# EAGLE schematic atmega32u4 (EAGLE 9.5.2)
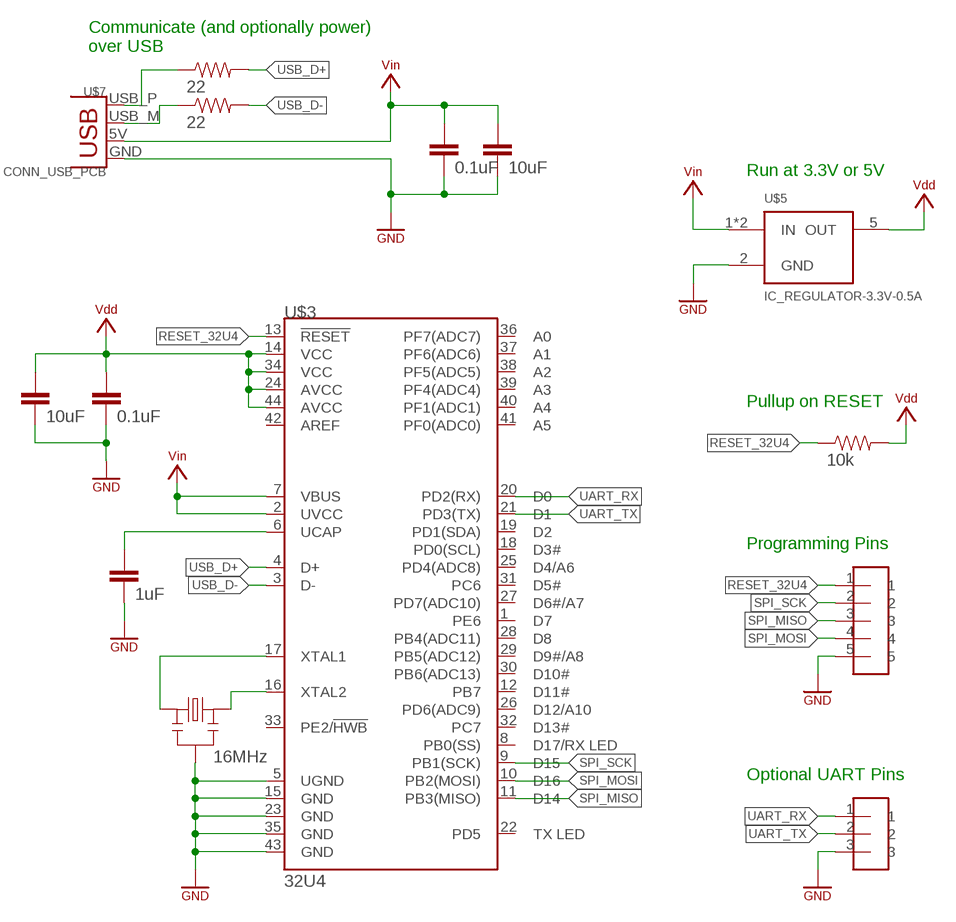
[diagram p0: schematic, sheet 1]

## Parts
C1  0.1uF  COMPONENT_CAP-0805  [0805]
C2  10uF  COMPONENT_CAP-0805  [0805]
C3  1uF  COMPONENT_CAP-0805  [0805]
C4  0.1uF  COMPONENT_CAP-0805  [0805]
C5  10uF  COMPONENT_CAP-0805  [0805]
R1  10k  COMPONENT_RESISTOR-0805  [0805]
R2  22  COMPONENT_RESISTOR-0805  [0805]
R3  22  COMPONENT_RESISTOR-0805  [0805]
U$1  HEADER-3-TESTPOINT  [TESTPOINT-3]
U$2  HEADER-5-TESTPOINT  [TESTPOINT-5]
U$3  32U4  MICRO_ATMEGA32U4TQFP-44  [TQFP44]
U$5  IC_REGULATOR-3.3V-0.5A  [SOT23-5]
U$7  CONN_USB_PCB  [USB-PCB]
Y1  16MHz  COMPONENT_RESONATOR-1.2MM-PITCH  [RESONATOR-SMD]

## Nets
GND: C1.2 C2.2 C3.2 C4.2 C5.2 U$1.3 U$2.5 U$3.5(UGND) U$3.15(GND) U$3.23(GND) U$3.35(GND) U$3.43(GND) U$5.2(GND) U$7.GND Y1.2 ; supply symbol labelled SYMBOL_GND
N$1: U$3.17(XTAL1) Y1.1
N$2: U$3.16(XTAL2) Y1.3
N$3: C3.1 U$3.6(UCAP)
N$5: R3.1 U$7.USB_M(D-)
N$6: R2.1 U$7.USB_P(D+)
RESET_32U4: R1.1 U$2.1 U$3.13(!RESET)
SPI_MISO: U$2.3 U$3.11(PB3(MISO))
SPI_MOSI: U$2.4 U$3.10(PB2(MOSI))
SPI_SCK: U$2.2 U$3.9(PB1(SCK))
UART_RX: U$1.1 U$3.20(PD2(RX))
UART_TX: U$1.2 U$3.21(PD3(TX))
USB_D+: R2.2 U$3.4(D+)
USB_D-: R3.2 U$3.3(D-)
VDD: C1.1 C2.1 R1.2 U$3.14(VCC) U$3.24(AVCC) U$3.34(VCC) U$3.44(AVCC) U$5.5(OUT) ; supply symbol labelled SYMBOL_VDD
VIN: C4.1 C5.1 U$3.2(UVCC) U$3.7(VBUS) U$5.1(IN) U$5.3(IN) U$7.5V(VBUS) ; supply symbol labelled SYMBOL_VIN
Unconnected: U$3.1(PE6) U$3.8(PB0(SS)) U$3.12(PB7) U$3.18(PD0(SCL)) U$3.19(PD1(SDA)) U$3.22(PD5) U$3.25(PD4(ADC8)) U$3.26(PD6(ADC9)) U$3.27(PD7(ADC10)) U$3.28(PB4(ADC11)) U$3.29(PB5(ADC12)) U$3.30(PB6(ADC13)) U$3.31(PC6) U$3.32(PC7) U$3.33(PE2/!HWB) U$3.36(PF7(ADC7)) U$3.37(PF6(ADC6)) U$3.38(PF5(ADC5)) U$3.39(PF4(ADC4)) U$3.40(PF1(ADC1)) U$3.41(PF0(ADC0)) U$3.42(AREF)

## Notes on the sheet
- Communicate (and optionally power)
  over USB
- Run at 3.3V or 5V
- Pullup on RESET
- Programming Pins
- Optional UART Pins

## Library data of the parts
C1-C5 = homemade-hardware:COMPONENT_CAP: Capacitor Standard 0603 ceramic capacitor, and 0.1" leaded capacitor.
R1-R3 = homemade-hardware:COMPONENT_RESISTOR
U$1 = homemade-hardware:HEADER-3: NPTC081KFXC-RC <https://www.digikey.com/product-detail/en/sullins-connector-solutions/NPTC081KFXC-RC/S5600-ND/776058>: Vertical Female SMD Headers TSM-110-01-T-SV <https://www.digikey.com/product-detail/en/samtec-inc/TSM-110-01-T-SV/SAM12267-ND/6691889>: Vertical Male SMD Headers M20-8890845 <https://www.digikey.com/products/en?keywords=952-3236-ND>: Horizontal Male SMD Headers M20-7910842R <https://www.digikey.com/product-detail/en/harwin-inc/M20-7910842R/952-3200-6-ND/6559341>: Horizontal Female SMD Headers
U$2 = homemade-hardware:HEADER-5: NPTC081KFXC-RC <https://www.digikey.com/product-detail/en/sullins-connector-solutions/NPTC081KFXC-RC/S5600-ND/776058>: Vertical Female SMD Headers TSM-110-01-T-SV <https://www.digikey.com/product-detail/en/samtec-inc/TSM-110-01-T-SV/SAM12267-ND/6691889>: Vertical Male SMD Headers M20-8890845 <https://www.digikey.com/products/en?keywords=952-3236-ND>: Horizontal Male SMD Headers M20-7910842R <https://www.digikey.com/product-detail/en/harwin-inc/M20-7910842R/952-3200-6-ND/6559341>: Horizontal Female SMD Headers
U$3 = homemade-hardware:MICRO_ATMEGA32U4: ATMEGA32U4-AUR: Native USB Microcontroller (used in Arduino Leonardo); PROD_ID: IC-11161
U$5 = homemade-hardware:IC_REGULATOR: SPX3819M5-L-5-0/TR <https://www.digikey.com/product-detail/en/maxlinear-inc/SPX3819M5-L-5-0-TR/1016-1874-6-ND/3586704>: 5.0V/0.5A SMD Linear Regulator SPX3819M5-L-3-3/TR <https://www.digikey.com/product-detail/en/maxlinear-inc/SPX3819M5-L-3-3-TR/1016-1873-6-ND/3586703>: 3.3V/0.5A SMD Linear Regulator; PN: SPX3819M5-L-3-3/TR
U$7 = homemade-hardware:CONN_USB_PCB
Y1 = homemade-hardware:COMPONENT_RESONATOR: CSTNE8M00GH5C000R0 <https://www.digikey.com/product-detail/en/murata-electronics-north-america/CSTNE8M00GH5C000R0/490-17961-1-ND/8747769>: 8MHz resonator CSTNE12M0G55Z000R0 <https://www.digikey.com/product-detail/en/murata-electronics-north-america/CSTNE12M0G55Z000R0/490-17945-6-ND/8747780>: 12MHz resonator CSTNE16M0VH3C000R0 <https://www.digikey.com/product-detail/en/murata-electronics-north-america/CSTNE16M0VH3C000R0/490-17951-1-ND/8747759>: 16MHz resonator